# EAGLE design Echo locator (EAGLE 7.6.0)
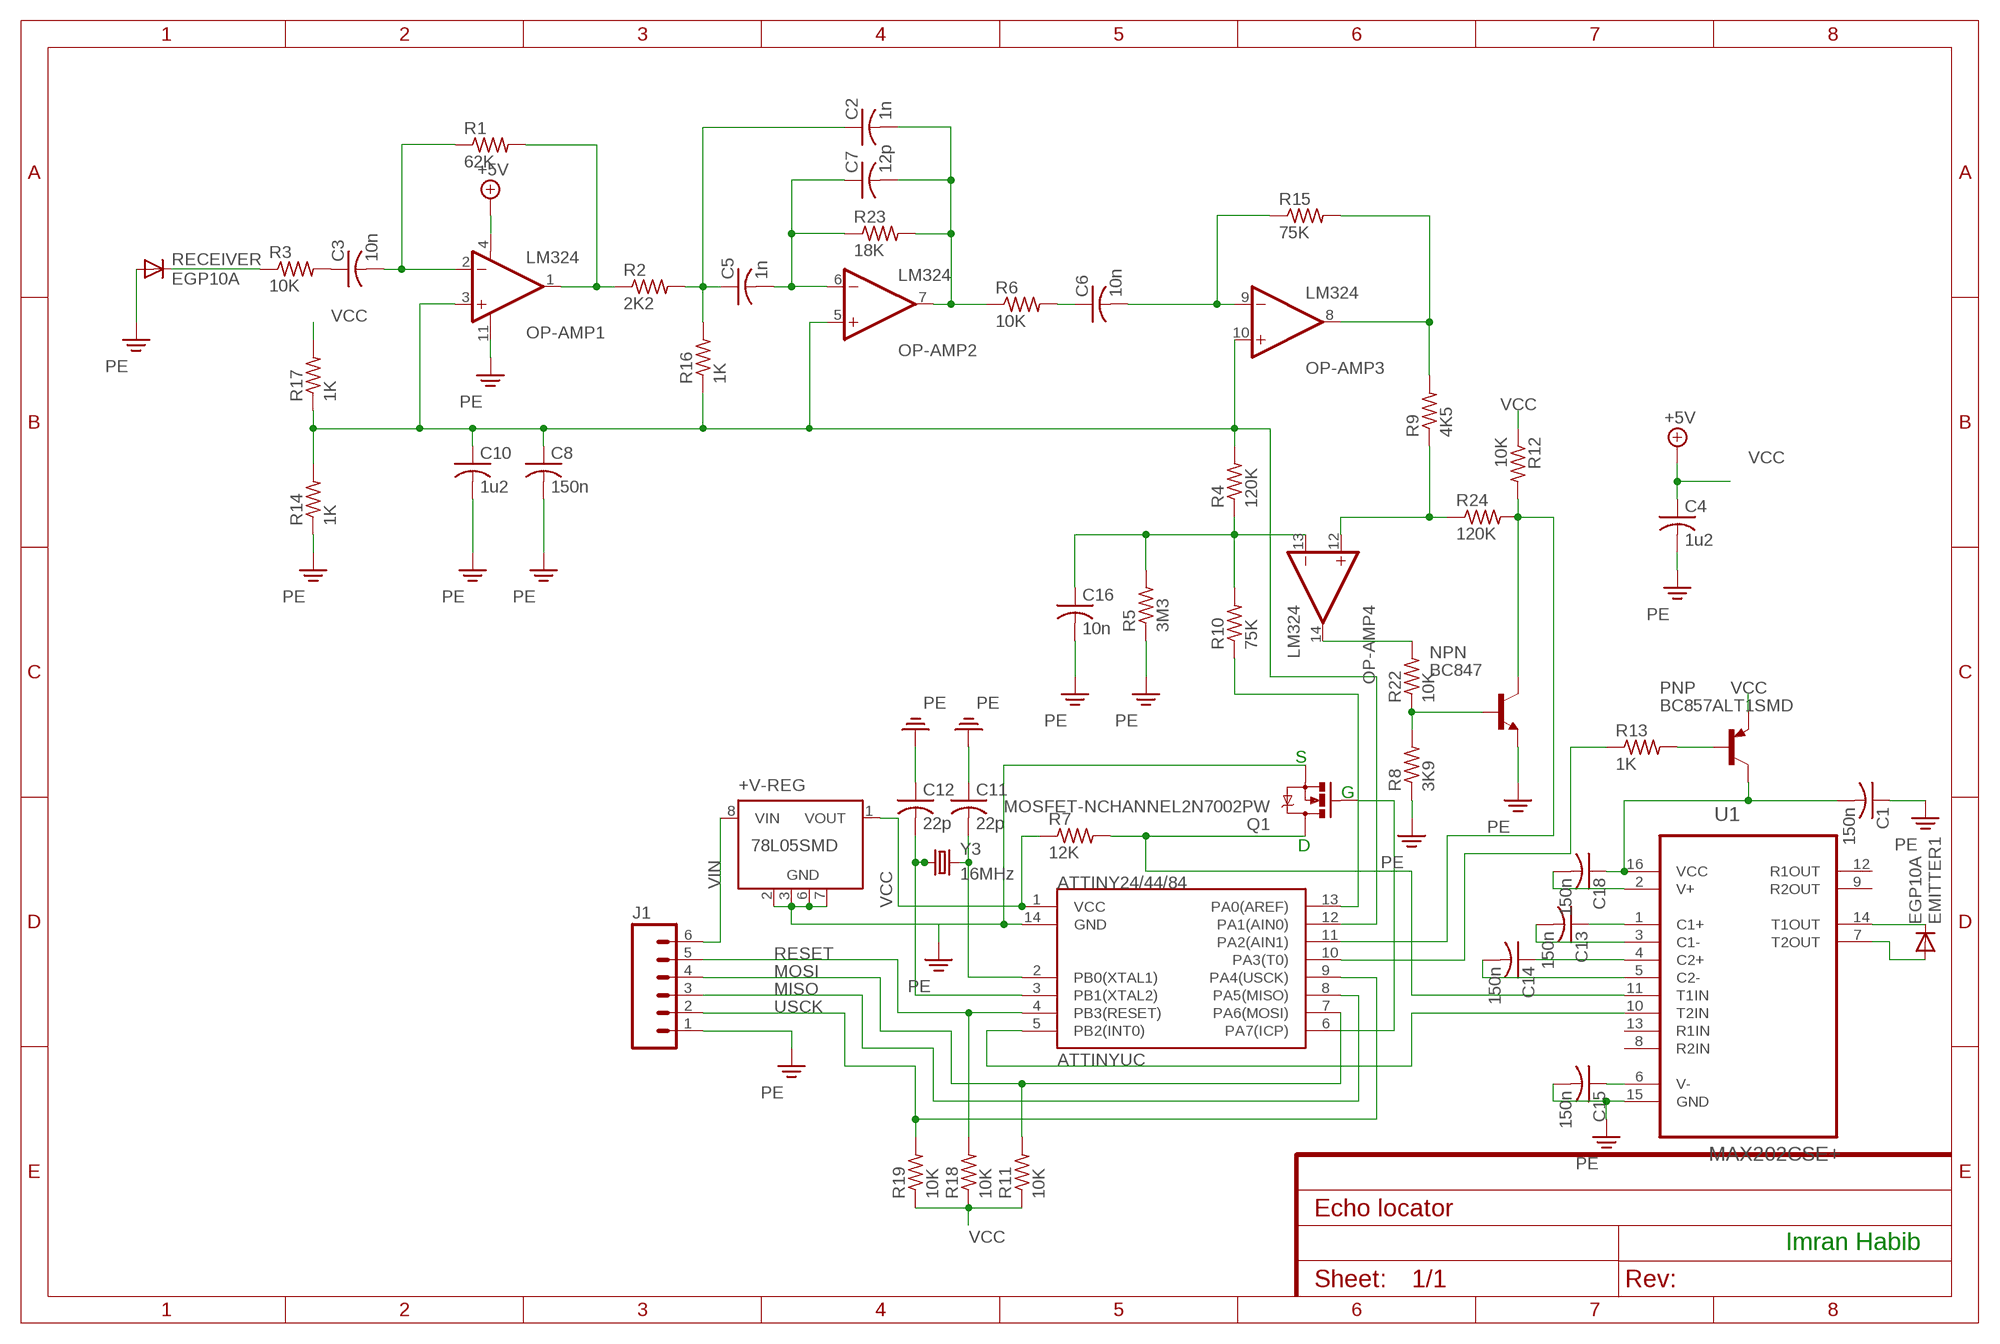
[diagram p0: schematic, sheet 1]

## Parts
+V-REG  78L05SMD  [SO08]
ATTINYUC  ATTINY24  [SOIC-14]
C1  150n  C-USC0805  [C0805]
C2  1n  C-USC0805  [C0805]
C3  10n  C-USC0805  [C0805]
C4  1u2  C-USC0805  [C0805]
C5  1n  C-USC0805  [C0805]
C6  10n  C-USC0805  [C0805]
C7  12p  C-USC0805  [C0805]
C8  150n  C-USC0805  [C0805]
C10  1u2  C-USC0805  [C0805]
C11  22p  C-USC0805  [C0805]
C12  22p  C-USC0805  [C0805]
C13  150n  C-USC0805  [C0805]
C14  150n  C-USC0805  [C0805]
C15  150n  C-USC0805  [C0805]
C16  10n  C-USC0805  [C0805]
C18  150n  C-USC0805  [C0805]
EMITTER1  EGP10A  [DO41-10]
J1  M06LONGPADS  [1X06_LONGPADS]
NPN  BC847  [SOT23]
OP-AMP  LM324  [SOIC-14]
PNP  BC857ALT1SMD  [SOT23-BEC]
Q1  MOSFET-NCHANNEL2N7002PW  [SOT323]
R1  62K  R-US_M2012  [M2012]
R2  2K2  R-US_M2012  [M2012]
R3  10K  R-US_M2012  [M2012]
R4  120K  R-US_M2012  [M2012]
R5  3M3  R-US_M2012  [M2012]
R6  10K  R-US_M2012  [M2012]
R7  12K  R-US_M0805  [M0805]
R8  3K9  R-US_M2012  [M2012]
R9  4K5  R-US_M2012  [M2012]
R10  75K  R-US_M2012  [M2012]
R11  10K  R-US_M2012  [M2012]
R12  10K  R-US_M2012  [M2012]
R13  1K  R-US_M2012  [M2012]
R14  1K  R-US_M2012  [M2012]
R15  75K  R-US_M2012  [M2012]
R16  1K  R-US_M2012  [M2012]
R17  1K  R-US_M2012  [M2012]
R18  10K  R-US_M2012  [M2012]
R19  10K  R-US_M2012  [M2012]
R22  10K  R-US_M2012  [M2012]
R23  18K  R-US_M2012  [M2012]
R24  120K  R-US_M2012  [M2012]
RECEIVER  EGP10A  [DO41-10]
U1  MAX202CSE+  [SOIC127P600X175-16N]
Y3  16MHz  CRYSTALHC49US  [HC49US]

## Nets
C1+: C13.1 U1.1(C1+)
GND: +V-REG.2(GND) +V-REG.3(GND) +V-REG.6(GND) +V-REG.7(GND) ATTINYUC.14(GND) C1.1 C4.2 C8.2 C10.2 C11.1 C12.1 C15.2 C16.2 J1.1 NPN.2(E) OP-AMP.11(1:V-) Q1.2(S) R5.1 R8.1 R14.1 RECEIVER.A U1.15(GND) ; supply symbol labelled PE
ICP: ATTINYUC.6(PA7(ICP)) Q1.1(G)
MISO: ATTINYUC.8(PA5(MISO)) J1.3
MOSI: ATTINYUC.7(PA6(MOSI)) J1.4 R11.2
N$1: C3.1 R3.2
N$2: C3.2 OP-AMP.2(1:-IN) R1.1
N$3: C15.1 U1.6(V-)
N$4: OP-AMP.1(1:OUT) R1.2 R2.1
N$5: C2.1 C5.1 R2.2 R16.2
N$6: C5.2 C7.1 OP-AMP.6(2:-IN) R23.1
N$7: C6.1 R6.2
N$8: C2.2 C7.2 OP-AMP.7(2:OUT) R6.1 R23.2
N$9: C6.2 OP-AMP.9(3:-IN) R15.1
N$11: OP-AMP.8(3:OUT) R9.2 R15.2
N$12: OP-AMP.14(4:OUT) R22.2
N$13: OP-AMP.12(4:+IN) R9.1 R24.1
N$14: NPN.1(B) R8.2 R22.1
N$16: C16.1 OP-AMP.13(4:-IN) R4.1 R5.2 R10.2
N$18: PNP.B R13.2
N$21: R3.1 RECEIVER.C
N$28: ATTINYUC.5(PB2(INT0)) U1.10(T2IN)
N$40: Q1.3(D) R7.2 U1.11(T1IN)
N$42: C13.2 U1.3(C1-)
N$43: C14.1 U1.4(C2+)
N$44: C14.2 U1.5(C2-)
N$46: C18.2 U1.2(V+)
N$49: EMITTER1.C U1.14(T1OUT)
N$50: EMITTER1.A U1.7(T2OUT)
PA0: ATTINYUC.13(PA0(AREF)) R10.1
PA1: ATTINYUC.12(PA1(AIN0)) C8.1 C10.1 OP-AMP.3(1:+IN) OP-AMP.5(2:+IN) OP-AMP.10(3:+IN) R4.2 R14.2 R16.1 R17.1
PA2: ATTINYUC.11(PA2(AIN1)) NPN.3(C) R12.2 R24.2
PA3: ATTINYUC.10(PA3(T0)) R13.1
PB0: ATTINYUC.2(PB0(XTAL1)) C11.2 Y3.2
PB1: ATTINYUC.3(PB1(XTAL2)) C12.2 Y3.1
RESET: ATTINYUC.4(PB3(RESET)) J1.5 R18.2
USCK: ATTINYUC.9(PA4(USCK)) J1.2 R19.2
VCC: +V-REG.1(VOUT) ATTINYUC.1(VCC) C4.1 OP-AMP.4(1:V+) PNP.E R7.1 R11.1 R12.1 R17.2 R18.1 R19.1 ; supply symbol labelled +5V
VIN: +V-REG.8(VIN) J1.6
WIRE: C1.2 C18.1 PNP.C U1.16(VCC)
Unconnected: +V-REG.4(NC) +V-REG.5(NC) U1.8(R2IN) U1.9(R2OUT) U1.12(R1OUT) U1.13(R1IN)

## Notes on the sheet
- S
- G
- D
- Imran Habib

## Library data of the parts
+V-REG = linear:78L*SMD: Positive VOLTAGE REGULATOR
ATTINYUC = seanvoisen:ATTINY24: Atmel ATtiny24/44/84 Microcontroller
C1-C8 C10-C16 C18 = rcl:C-US: CAPACITOR, American symbol
EMITTER1 RECEIVER = diode:EGP10A: DIODE ultra fast-recovery rectifier
J1 = SparkFun-Connectors:M06: Header 6 Standard 6-pin 0.1" header. Use with straight break away headers (SKU : PRT-00116), right angle break away headers (PRT-00553), swiss pins (PRT-00743), machine pins (PRT-00117), and female headers (PRT-00115). Molex polarized connector foot print use with SKU : PRT-08094 with associated crimp pins and housings. NOTES ON THE VARIANTS LOCK and LOCK_LONGPADS... This footprint was designed to help hold the alignment of a through-hole component (i.e. 6-pin header) while soldering it into place. You may notice that each hole has been shifted either up or down by 0.005 of an inch from it's more standard position (which is a perfectly straight line). This slight alteration caused the pins (the squares in the middle) to touch the edges of the holes. Because they are alternating, it causes a "brace" to hold the component in place. 0.005 has proven to be the perfect amount of "off-center" position when using our standard breakaway headers. Although looks a little odd when you look at the bare footprint, once you have a header in there, the alteration is very hard to notice. Also,if you push a header all the way into place, it is covered up entirely on the bottom side. This idea of altering the position of holes to aid alignment will be further integrated into the Sparkfun Library for other footprints. It can help hold any component with 3 or more connection pins.
NPN = transistor:BC847: NPN TRANSISTOR
OP-AMP = seanvoisen:LM324: LM324 Quad Op-amp
PNP = transistor-pnp:BC857*: PNP Transistror
Q1 = SparkFun-DiscreteSemi:MOSFET-NCHANNEL: Common NMOSFET Parts MFG P/N Store ID Prod ID FDD8780 TRANS-09984 SI7820DN TRANS-11055 FDS6630A IC-08089 2N7002PW TRANS-11151 FQP30N06L COM-10213 TRANS-10060 BSS123LT1G TRANS-08345 BSS138 TRANS-00830 BS170 2N7000; PROD_ID: TRANS-11151
R1-R19 R22-R24 = rcl:R-US_: RESISTOR, American symbol
U1 = Maxim_By_element14_Batch_1:MAX202CSE+: Transceivers; MPN: MAX202CSE+; OC_FARNELL: 9725989; OC_NEWARK: 87H1303; PACKAGE: SOIC-16; SUPPLIER: Maxim
Y3 = SparkFun-FreqCtrl:CRYSTAL: Various standard crystals. Proven footprints.

## Board
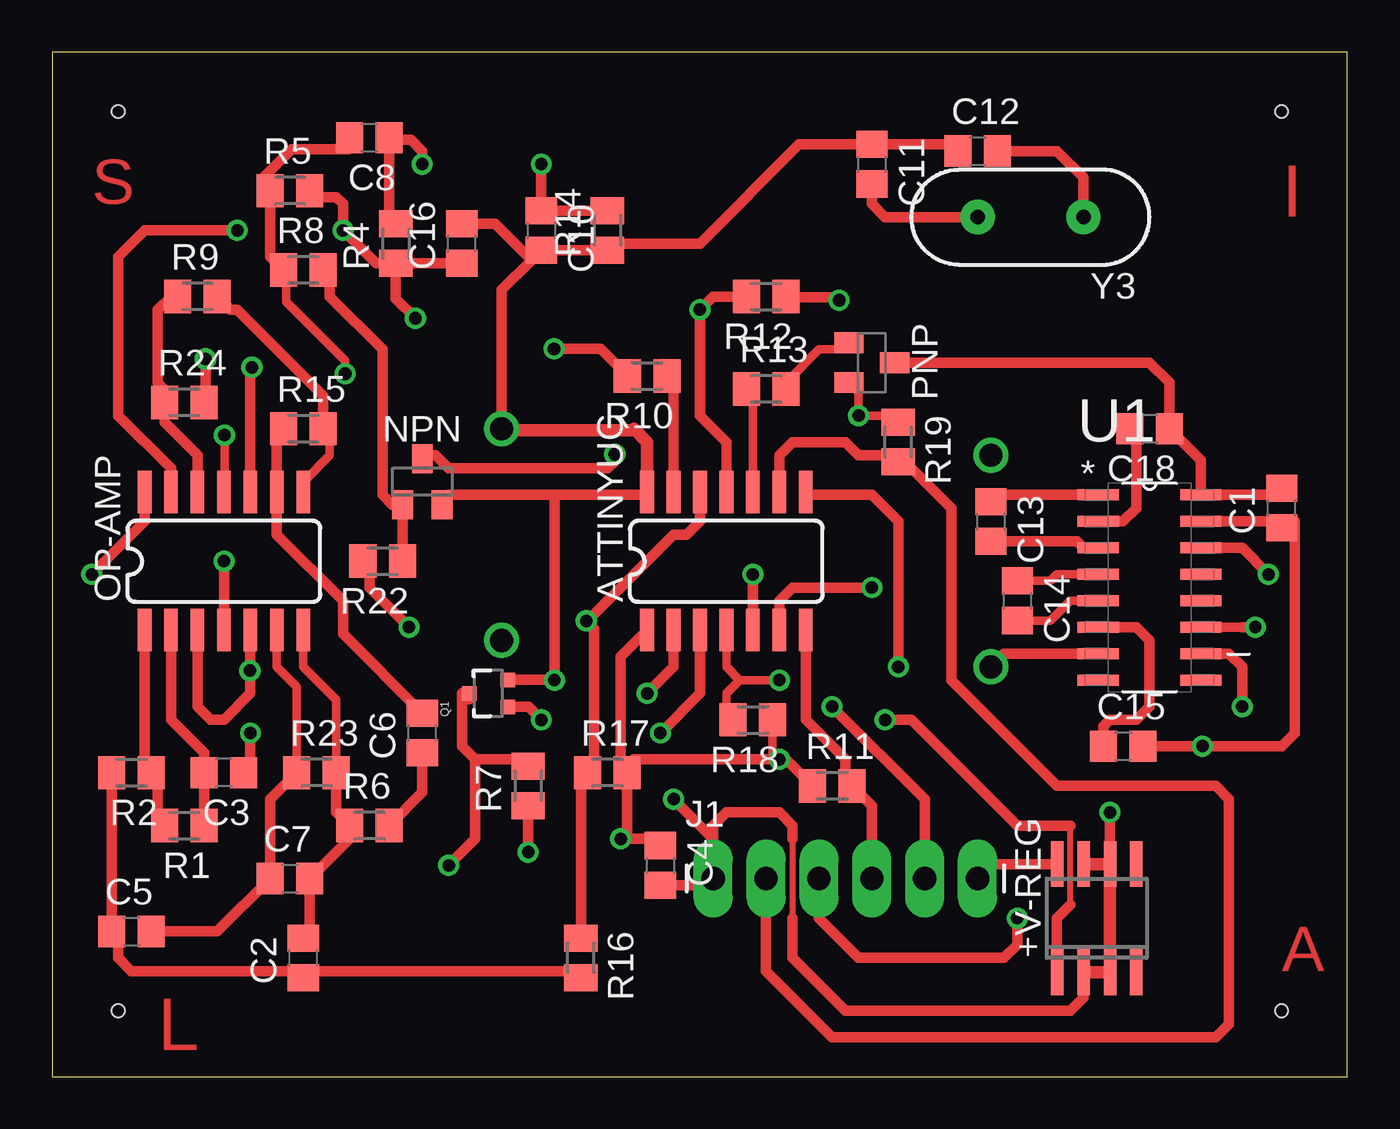
[diagram p1: board, top side]
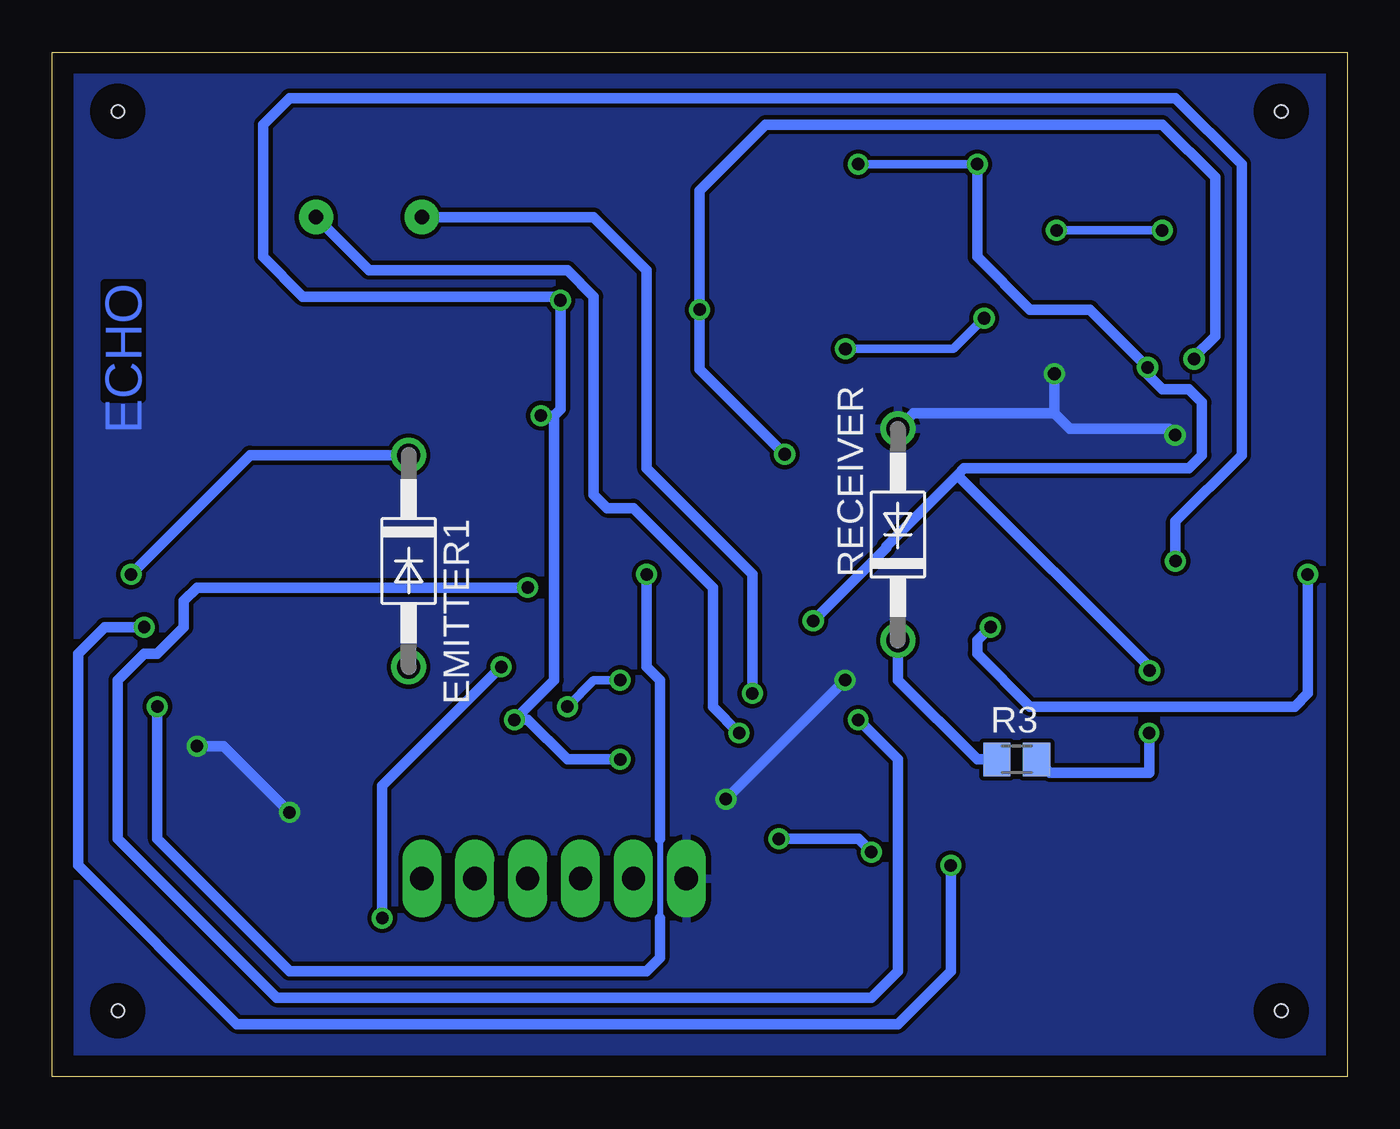
[diagram p2: board, bottom side, seen from below]

Size 62.21 x 49.2 mm. Coordinates in mm from the lower left corner, seen from the top.
Outline: 0,0 62.21,0 62.21,49.2 0,49.2 0,0
Copper layers (1*16): Top 0.035mm / dielectric 1.5mm / Bottom 0.035mm
Design rules "default": minimum track width 10mil, minimum drill 24mil, track to track 8mil, track to pad 8mil, pad to pad 8mil, via to via 8mil, smd to smd 8mil, copper to edge 40mil, drill to drill 8mil, minimum pad ring 10mil, minimum via ring 8mil, stop-mask expansion 4mil, vias tented up to drill 0mil, thermal gap 10mil
Holes 0.6 mm at 59.05,3.17 3.17,3.17 3.17,46.36 59.05,46.36

### Footprints (pad centres in the part's own frame; a part is rotated, then mirrored left to right if it is on the bottom)
SO08 = smd 0.6 x 2.2: 1 -1.905,-2.6; 2 -0.635,-2.6; 3 0.635,-2.6; 4 1.905,-2.6; 5 1.905,2.6; 6 0.635,2.6; 7 -0.635,2.6; 8 -1.905,2.6
SOIC-14 = smd 0.66 x 2.032: 1 -4.445,-3.315; 2 -3.175,-3.315; 3 -1.905,-3.315; 4 -0.635,-3.315; 5 0.635,-3.315; 6 1.905,-3.315; 7 3.175,-3.315; 8 3.175,3.315; 9 1.905,3.315; 10 0.635,3.315; 11 -0.635,3.315; 12 -1.905,3.315; 13 -3.175,3.315; 14 -4.445,3.315
C0805 = smd 1.3 x 1.5: 1 -0.95,0; 2 0.95,0
DO41-10 = drill 1.118: A 5.08,0; C -5.08,0
1X06_LONGPADS = drill 1.118 pad 1.88 long: 1 0,0; 2 2.54,0; 3 5.08,0; 4 7.62,0; 5 10.16,0; 6 12.7,0
SOT23 = smd 1 x 1.4: 1 -0.95,-1.1; 2 0.95,-1.1; 3 0,1.1
SOT23-BEC = smd 1 x 1.4: B -0.95,-1.1; C 0,1.1; E 0.95,-1.1
SOT323 = smd 0.7 x 0.7: 1 -0.65,-0.925; 2 0.65,-0.925; 3 0,0.925
M2012 = smd 1.3 x 1.6: 1 -0.95,0; 2 0.95,0
M0805 = smd 1.3 x 1.6: 1 -0.95,0; 2 0.95,0
SOIC127P600X175-16N = smd 1.981 x 0.533: 1 -2.464,4.445; 2 -2.464,3.175; 3 -2.464,1.905; 4 -2.464,0.635; 5 -2.464,-0.635; 6 -2.464,-1.905; 7 -2.464,-3.175; 8 -2.464,-4.445; 9 2.464,-4.445; 10 2.464,-3.175; 11 2.464,-1.905; 12 2.464,-0.635; 13 2.464,0.635; 14 2.464,1.905; 15 2.464,3.175; 16 2.464,4.445
HC49US = drill 0.7 pad 1.651: 1 -2.54,0; 2 2.54,0

### Placement (x,y rotation side)
+V-REG  50.16,7.62 0 top
ATTINYUC  33.02,24.77 0 top
C1  59.05,27.3 90 top
C2  12.06,5.71 90 top
C3  8.26,14.61 180 top
C4  29.21,10.16 270 top
C5  3.81,6.98 0 top
C6  17.78,16.51 90 top
C7  11.43,9.53 0 top
C8  15.24,45.09 180 top
C10  23.5,40.64 270 top
C11  39.37,43.82 270 top
C12  44.45,44.45 0 top
C13  45.09,26.67 270 top
C14  46.35,22.86 270 top
C15  51.44,15.88 0 top
C16  19.68,40.01 90 top
C18  52.7,31.11 180 top
EMITTER1  45.09,24.77 270 bottom
J1  31.75,9.53 0 top
NPN  17.78,28.57 0 top
OP-AMP  8.89,24.77 0 top
PNP  39.37,34.29 270 top
Q1  20.95,18.41 90 top
R1  6.35,12.06 180 top
R2  3.81,14.61 180 top
R3  15.88,15.24 0 bottom
R4  16.51,40.01 90 top
R5  11.43,42.55 0 top
R6  15.24,12.06 0 top
R7  22.86,13.97 90 top
R8  12.06,38.74 0 top
R9  6.99,37.47 0 top
R10  28.57,33.66 180 top
R11  37.47,13.97 0 top
R12  34.29,37.47 180 top
R13  34.29,33.02 0 top
R14  26.67,40.64 90 top
R15  12.06,31.11 0 top
R16  25.4,5.71 270 top
R17  26.67,14.61 0 top
R18  33.66,17.14 180 top
R19  40.64,30.48 270 top
R22  15.88,24.77 180 top
R23  12.7,14.61 0 top
R24  6.35,32.38 0 top
RECEIVER  21.59,26.04 90 bottom
U1  52.7,23.5 0 top
Y3  46.99,41.28 180 top

### Tracks (layer width: path | path; a pad name or v marks a point on that pad's centre or on a via)
C1+
  Top 0.5: U1.1 45.41,27.94 C13.1
GND  (via drill 0.6, 0.61)
  Top 0.254: 14.22,44.53 14.22,44.98 C8.2 | 26.57,39.73 R14.1 | 18.8,27.61 NPN.2 18.57,27.61 | 28.4,28.07 ATTINYUC.14 28.4,28.3 | 11.25,38.58 R8.1 | 8.28,28.3 OP-AMP.11 | 21.77,31.04 RECEIVER.A
  Top 0.3: 35.56,11.43 35.56,7.62
  Top 0.406: R8.1 11.25,38.6 11.25,37.21 14.07,34.39 v14.07,33.76 | 27.94,31.11 RECEIVER.A | 8.28,28.3 v8.28,30.81
  Top 0.5: 31.75,11.43 31.75,12.06 32.38,12.7 34.92,12.7 35.56,12.06 35.56,11.43 | 35.56,7.62 35.56,5.71 38.1,3.17 48.9,3.17 49.53,3.81 +V-REG.2 | RECEIVER.A 21.59,37.79 23.02,39.21 | 23.02,39.21 C10.2 R14.1 26.98,40.01 31.11,40.01 35.88,44.77 C11.1 43.19,44.77 C12.1 | Q1.2 24.11,19.07 | v24.13,19.05 24.11,19.07 | 18.8,27.61 18.8,27.69 19.05,27.94 24.13,27.94 | 24.13,27.94 24.13,19.08 24.11,19.07 | 24.13,27.94 28.43,27.94 ATTINYUC.14 | C16.2 21.27,40.96 23.02,39.21 | R8.1 10.48,39.37 R5.1 10.16,42.87 10.16,43.18 11.51,44.53 14.22,44.53 | 31.75,11.43 v29.84,13.33 | 31.75,11.43 J1.1 31.43,9.21 C4.2 | C1.1 58.74,26.67 U1.15 59.69,26.67 59.69,16.51 59.05,15.88 v55.24,15.88 C15.2 | +V-REG.6 v50.8,12.7
  Top 0.61: 21.77,31.04 27.86,31.04 27.94,31.11 28.57,30.48 ATTINYUC.14 | +V-REG.7 +V-REG.6 +V-REG.3 +V-REG.2
  Bottom 0.254: 21.77,31.04 RECEIVER.A
  Bottom 0.5: v8.28,30.81 8.59,31.11 13.34,31.11 14.07,31.85 | v14.07,33.76 14.07,31.85 | 14.07,31.85 20.85,31.85 RECEIVER.A | v29.84,13.33 v24.13,19.05 | v50.8,12.7 53.98,15.88 v55.24,15.88
  pour Bottom: 0,0 0,48.9 62.23,48.9 62.23,0
ICP  (via drill 0.6)
  Top 0.5: ATTINYUC.6 34.92,22.86 35.56,23.5 v39.37,23.5 | v23.5,17.14 22.88,17.77 Q1.1
  Bottom 0.5: v39.37,23.5 55.24,23.5 55.88,22.86 55.88,21.59 57.15,20.32 57.78,20.32 59.05,19.05 59.05,11.43 51.44,3.81 22.86,3.81 21.59,5.08 21.59,15.24 v23.5,17.14
MISO  (via drill 0.6)
  Top 0.5: J1.3 36.83,7.62 38.73,5.71 45.72,5.71 46.35,6.35 v46.35,7.62 | v40.64,19.68 40.64,26.67 39.37,27.94 36.34,27.94 ATTINYUC.8
  Bottom 0.5: v46.35,7.62 46.35,13.97 v40.64,19.68
MOSI
  Top 0.5: J1.4 39.37,13.01 R11.2 38.1,14.29 38.1,15.24 36.2,17.14 ATTINYUC.7
N$1  (via drill 0.6)
  Top 0.5: C3.1 9.53,14.92 v9.53,16.51
  Bottom 0.5: v9.53,16.51 9.53,14.61 14.29,14.61 R3.2
N$2
  Top 0.5: OP-AMP.2 5.71,17.14 7.3,15.55 C3.2 R1.1
N$3
  Top 0.5: U1.6 52.07,21.59 52.7,20.95 52.7,17.78 52.07,17.14 50.8,17.14 50.48,16.83 C15.1
N$4
  Top 0.5: OP-AMP.1 4.45,14.61 R2.1 4.76,14.29 5.08,13.97 5.08,12.38 R1.2
N$5
  Top 0.5: R2.2 C5.1 3.17,6.67 3.17,5.71 3.81,5.08 12.06,5.08 C2.1 12.38,5.08 25.4,5.08 R16.2
N$6
  Top 0.406: OP-AMP.6 10.79,19.68 11.75,18.73 R23.1
  Top 0.5: C5.2 7.94,6.98 C7.1 10.48,13.33 R23.1
N$7
  Top 0.5: R6.2 17.78,13.65 C6.1
N$8
  Top 0.406: OP-AMP.7 12.06,19.68 13.65,18.1 R23.2
  Top 0.5: C2.2 12.38,6.98 C7.2 14.29,11.43 R6.1 13.65,12.71 R23.2
N$9
  Top 0.5: C6.2 13.97,21.27 13.97,22.86 10.79,26.04 OP-AMP.9 10.79,31.11 R15.1
N$11
  Top 0.254: 12.17,28.3 OP-AMP.8
  Top 0.406: 12.17,28.3 12.17,28.68 13.34,29.84 13.34,30.79 R15.2
  Top 0.5: R15.2 13.02,32.7 8.89,36.83 8.57,36.83 R9.2
N$12  (via drill 0.6)
  Top 0.5: R22.2 15.24,24.45 15.24,23.5 v17.14,21.59 | v1.91,24.13 4.45,26.67 OP-AMP.14
  Bottom 0.5: v17.14,21.59 17.78,20.95 17.78,20.32 15.24,17.78 2.54,17.78 1.91,18.41 v1.91,24.13
N$13
  Top 0.406: R24.1 5.71,32.7
  Top 0.5: OP-AMP.12 6.99,29.84 5.4,31.43 R24.1 | 5.71,32.7 5.08,33.34 5.08,36.83 5.71,37.47 R9.1
N$14
  Top 0.5: R22.1 NPN.1 16.34,27.47 15.88,27.94 15.88,34.93 13.34,37.47 13.34,38.42 R8.2
N$16  (via drill 0.6, 0.61)
  Top 0.254: 5.54,28.3 OP-AMP.13
  Top 0.406: 12.38,42.23 R5.2
  Top 0.5: v8.89,40.64 4.45,40.64 3.17,39.37 3.17,31.75 5.71,29.21 OP-AMP.13 | R4.1 16.51,37.36 v17.45,36.42 | 12.38,42.23 13.65,42.23 13.97,41.91 v13.97,40.64 15.55,39.05 R4.1 | R4.1 C16.1 | v24.11,34.95 26.33,34.95 R10.2
  Bottom 0.406: v24.11,34.95 18.92,34.95 v17.45,36.42 | v8.89,40.64 v13.97,40.64
N$18
  Top 0.254: 35.7,32.55 R13.2
  Top 0.406: PNP.B 37.95,34.93 36.83,34.93 35.24,33.34 R13.2
N$21
  Bottom 0.5: R3.1 17.78,15.24 21.59,19.05 RECEIVER.C
N$28  (via drill 0.6)
  Top 0.5: ATTINYUC.5 v33.66,24.13 | v57.15,17.78 57.15,19.68 56.52,20.32 U1.10
  Bottom 0.3: 33.02,11.43 33.02,7.62
  Bottom 0.5: v33.66,24.13 33.66,19.68 33.02,19.05 33.02,11.43 | 33.02,7.62 33.02,5.71 33.66,5.08 50.8,5.08 57.15,11.43 v57.15,17.78
N$40  (via drill 0.6)
  Top 0.45: U1.11 57.15,21.59
  Top 0.5: 57.15,21.59 v57.78,21.59 | 20.03,18.12 Q1.3 19.68,18.41 19.68,15.88 20.32,15.24 | 20.32,15.24 22.54,15.24 R7.2 | v19.05,10.16 20.32,11.43 20.32,15.24
  Bottom 0.5: v57.78,21.59 59.69,21.59 60.96,20.32 60.96,10.16 53.34,2.54 21.59,2.54 19.05,5.08 v19.05,10.16
N$42
  Top 0.5: C13.2 49.21,25.72 49.53,25.4 U1.3
N$43
  Top 0.406: C14.1 47.94,23.81 48.26,24.13 U1.4
N$44
  Top 0.406: C14.2 47.95,21.91 48.9,22.86 U1.5
N$46
  Top 0.5: U1.2 51.44,26.67 52.07,27.3 52.07,30.48 51.76,30.79 C18.2
N$49  (via drill 0.6)
  Top 0.5: U1.14 57.15,25.4 v58.42,24.13
  Bottom 0.5: v58.42,24.13 52.7,29.84 EMITTER1.C
N$50
  Top 0.5: U1.7 45.72,20.32 EMITTER1.A
PA0
  Top 0.5: ATTINYUC.13 29.84,33.34 R10.1
PA1  (via drill 0.6, 0.61)
  Top 0.254: 26.57,41.78 R14.2 | 16.28,44.98 C8.1
  Top 0.406: 25.7,21.89 v25.65,21.89
  Top 0.5: v25.65,21.89 26.04,21.51 26.04,14.92 R17.1 25.72,14.29 25.4,13.97 R16.1 | OP-AMP.10 9.53,33.99 v9.6,34.06 | R4.2 16.19,41.28 C8.1 | 16.28,44.98 17.25,44.98 17.78,44.45 v17.78,43.82 | v23.5,43.82 C10.1 R14.2 | 25.7,21.89 29.84,26.04 30.48,26.04 31.11,26.67 ATTINYUC.12 | OP-AMP.3 6.99,17.78 7.62,17.14 8.26,17.14 9.53,18.41 9.53,19.48 v9.5,19.51 9.53,19.53 OP-AMP.5
  Bottom 0.406: 25.65,21.97 v25.65,21.89 | v23.5,43.82 v17.78,43.82
  Bottom 0.5: v25.65,21.89 22.15,25.4 22.15,25.48 18.73,28.89 | v17.78,43.82 17.78,39.37 15.24,36.83 12.37,36.83 v9.6,34.06 9.6,33.73 8.89,33.02 7.62,33.02 6.99,32.38 6.99,29.84 7.62,29.21 18.41,29.21 18.73,28.89 | v9.5,19.51 9.53,19.53 9.53,19.68 18.73,28.89
PA2  (via drill 0.6, 0.61)
  Top 0.254: 17.88,29.9 NPN.3 | 7.37,32.41 R24.2 | 33.2,37.44 R12.2
  Top 0.5: 7.37,32.41 v7.37,34.47 | v27.03,29.9 27.03,29.57 26.67,29.21 19.05,29.21 18.41,29.84 17.95,29.84 NPN.3 | ATTINYUC.11 32.38,30.48 31.11,31.75 v31.11,36.83 31.75,37.47 R12.2
  Bottom 0.5: v7.37,34.47 7.37,34.54 6.35,35.56 6.35,43.18 8.89,45.72 27.94,45.72 31.11,42.55 v31.11,36.83 31.11,33.99 v27.03,29.9
PA3
  Top 0.254: 33.66,32.7 R13.1
  Top 0.406: ATTINYUC.10 33.66,33.02 R13.1
PB0  (via drill 0.6)
  Top 0.5: C11.2 39.37,41.91 40.01,41.28 Y3.2 | ATTINYUC.2 29.84,19.68 v28.57,18.41
  Bottom 0.5: Y3.2 36.2,41.28 33.66,38.74 33.66,29.21 28.57,24.13 v28.57,18.41
PB1  (via drill 0.6)
  Top 0.5: C12.2 48.26,44.45 49.53,43.18 Y3.1 | ATTINYUC.3 31.11,18.41 v29.21,16.51
  Bottom 0.5: Y3.1 46.99,38.74 37.47,38.74 36.2,37.47 36.2,27.94 35.56,27.3 34.29,27.3 30.48,23.5 30.48,17.78 v29.21,16.51
RESET  (via drill 0.6)
  Top 0.406: v34.92,19.05 33.02,19.05 | 33.02,19.05 32.38,18.41 32.38,17.46 R18.2 | ATTINYUC.4 32.38,19.68 33.02,19.05
  Top 0.5: J1.5 41.91,13.33 v37.47,17.78
  Bottom 0.406: v37.47,17.78 36.2,19.05 v34.92,19.05
USCK
  Top 0.5: J1.2 34.29,5.08 37.47,1.91 55.88,1.91 56.52,2.54 56.52,13.33 55.88,13.97 48.26,13.97 43.18,19.05 43.18,27.3 40.95,29.53 R19.2 40.33,29.84 38.73,29.84 38.1,30.48 35.56,30.48 34.92,29.84 ATTINYUC.9 34.92,29.21
VCC  (via drill 0.6, 0.61)
  Top 0.254: 35.26,37.44 R12.1
  Top 0.3: 48.9,8.26 48.9,12.06
  Top 0.406: v34.92,15.24 34.6,15.56 R18.1 | PNP.E 38.73,32.88 v38.73,31.75 40.32,31.75 R19.1
  Top 0.5: +V-REG.1 48.26,7.62 48.9,8.26 | 35.26,37.44 37.64,37.44 v37.8,37.29 | R7.1 v22.86,10.79 | R11.1 35.24,15.24 v34.92,15.24 27.93,15.24 27.62,14.92 | 48.9,12.06 46.35,12.06 41.27,17.14 v40.01,17.14 | ATTINYUC.1 27.3,20.18 27.3,15.24 27.62,14.92 | 27.62,14.92 R17.2 27.62,11.74 v27.3,11.43 28.89,11.43 C4.1 | OP-AMP.4 v8.26,24.77
  Bottom 0.5: v34.92,15.24 37.47,15.24 39.37,17.14 v40.01,17.14 38.1,19.05 38.1,31.75 | v27.3,11.43 23.5,11.43 v22.86,10.79 | 38.1,31.75 v38.73,31.75 | 38.1,31.75 37.8,32.05 v37.8,37.29 37.97,37.47 50.16,37.47 52.07,39.37 52.07,45.72 50.8,46.99 8.26,46.99 5.08,43.82 5.08,29.84 8.26,26.67 v8.26,24.77
VIN
  Top 0.5: +V-REG.8 45.15,10.22 J1.6
WIRE
  Top 0.5: PNP.C 52.7,34.29 53.66,33.34 C18.1 55.17,29.6 U1.16 59.05,27.94 C1.2

### Text on the board
Top: S | I | A | L
Bottom: ECHO